# Altium schematic sheet AFE_Channel_4.SchDoc
size A; SheetNumber: 4; SheetTotal: 8; SPICEModelCacheNYXNLLFB: <root> / <DocumentId>NYXNLLFB</DocumentId> / <CacheFrame Number="0"> / <Model Name="mcp6401" Kind="CKT"> / <Text>.SUBCKT MCP6401 1 2 3 4 5 / *               | | | | | / *               | | | | Output / *               | | | Negative Supply / *               | | Positive Supply / *               | Inverting Input / *               Non-inverting Input / * / ******************************************************************************** / * Software License Agreement                                                   * / *                                                                              * / * The software supplied herewith by Microchip Technology Incorporated (the     * / * 'Company') is intended and supplied to you, the Company's customer, for use  * / * soley and exclusively on Microchip products.                                 * / *                                                                              * / * The software is owned by the Company and/or its supplier, and is protected   * / * under applicable copyright laws. All rights are reserved. Any use in         * / * violation of the foregoing restrictions may subject the user to criminal     * / * sanctions under applicable laws, as well as to civil liability for the       * / * breach of the terms and conditions of this license.                          * / *                                                                              * / * THIS SOFTWARE IS PROVIDED IN AN 'AS IS' CONDITION. NO WARRANTIES, WHETHER    * / * EXPRESS, IMPLIED OR STATUTORY, INCLUDING, BUT NOT LIMITED TO, IMPLIED        * / * WARRANTIES OF MERCHANTABILITY AND FITNESS FOR A PARTICULAR PURPOSE APPLY TO  * / * THIS SOFTWARE. THE COMPANY SHALL NOT, IN ANY CIRCUMSTANCES, BE LIABLE FOR    * / * SPECIAL, INCIDENTAL OR CONSEQUENTIAL DAMAGES, FOR ANY REASON WHATSOEVER.     * / ******************************************************************************** / * / * The following op-amps are covered by this model: / *      MCP6401, MCP6401R, MCP6401U, MCP6402, MCP6404, MCP6406, MCP6407, MCP6409 / * / * / * Revision History: / *      REV A: 10-Oct-10, Created model / *      REV B: 09-Jul-12, Added MCP6406, MCP6407, MCP6409 / * / * Recommendations: / *      Use PSPICE (or SPICE 2G6; other simulators may require translation) / *      For a quick, effective design, use a combination of: data sheet / *            specs, bench testing, and simulations with this macromodel / *      For high impedance circuits, set GMIN=100F in the .OPTIONS statement / * / * Supported: / *      Typical performance for temperature range (-40 to 125) degrees Celsius / *      DC, AC, Transient, and Noise analyses. / *      Most specs, including: offsets, DC PSRR, DC CMRR, input impedance, / *            open loop gain, voltage ranges, supply current, ... , etc. / *      Temperature effects for Ibias, Iquiescent, Iout short circuit / *            current, Vsat on both rails, Slew Rate vs. Temp and P.S. / * / * Not Supported: / *      Some Variation in specs vs. Power Supply Voltage / *      Vos distribution, Ib distribution for Monte Carlo / *      Distortion (detailed non-linear behavior) / *      Some Temperature analysis / *      Process variation / *      Behavior outside normal operating region / * / * / * Input Stage / V10  3 10 -400M / R10 10 11 1.00MEG / R11 10 12 1.00MEG / G10 10 11 10 11 100U / G11 10 12 10 12 100U / C11 11 12 397E-15 / C12  1  0 6P / E12 71 14 POLY(6) 20 0 21 0 22 0 23 0 26 0 27 0   4.5M 11.7 11.7 3.6 3.6 1 1 / G12 1 0 62 0 1m / G13 1 2 63 0 1u / M12 11 14 15 15 NMI / M14 12 2 15 15 NMI / G14 2 0 62 0 1m / C14  2  0 6P / C13 1 2 3P / I15 15 4 20.0U / V16 16 4 -200M / GD16 16 1 TABLE {V(16,1)} ((-100,-1p)(0,0)(1m,1u)(2m,1m)) / V13 3 13 -200M / GD13 2 13 TABLE {V(2,13)} ((-100,-1p)(0,0)(1m,1u)(2m,1m)) / R71  1  0 20.0E12 / R72  2  0 20.0E12 / R73  1  2 20.0E12 / * / * Noise, PSRR, and CMRR / I20 21 20 423U / D20 20  0 DN1 / D21  0 21 DN1 / I22 22 23 1N / R22 22 0  1k / R23  0 23 1k / G26  0 26 POLY(2) 3 0 4 0   0.00 -79.4U -100U / R26 26  0 1 / G27  0 27 POLY(2) 1 0 2 0  -847U 40U 40U / R27 27  0 1 / * / * Open Loop Gain, Slew Rate / G30  0 30 12 11 1 / R30 30  0 1.00K / G31 0 31 3 4 3.9 / I31 0 31 DC 51.5 / R31 31  0 1 TC=3.03M,2.40U / GD31 30 0 TABLE {V(30,31)} ((-100,-1n)(0,0)(1m,0.1)(2m,2)) / CD31 31 30 2p / G32 32 0 3 4 2.2 / I32 32 0 DC 93 / R32 32  0 1 TC=2.22M,-2.72U / GD32 0 30 TABLE {V(30,32)} ((-2m,2)(-1m,0.1)(0,0)(100,-1n)) / CD32 32 30 2p / G33  0 33 30 0 1m / R33  33 0 1K / G34  0 34 33 0 0.325 / R34  34 0 1K / C34  34 0 50.3U / G37  0 37 34 0 1m / R37  37 0 1K / C37  37 0 63.6P / G38  0 38 37 0 1m / R38  39 0 1K / L38  38 39 79.5U / E38  35 0 38 0 1 / G35 33 0 TABLE {V(35,3)} ((-1,-1n)(0,0)(90,1n))(91,1)) / G36 33 0 TABLE {V(35,4)} ((-91,-1)((-90,-1n)(0,0)(1,1n)) / * / * Output Stage / R80 50 0 100MEG / G50 0 50 57 96 2 / R58 57  96 0.50 / R57 57  0 1.2K / C58  5  0 2.00P / G57  0 57 POLY(3) 3 0 4 0 35 0 0 312U 416U 833U / GD55 55 57 TABLE {V(55,57)} ((-2m,-1)(-1m,-1m)(0,0)(10,1n)) / CD55 55 57 2p / CD56 57 56 2p / GD56 57 56 TABLE {V(57,56)} ((-2m,-1)(-1m,-1m)(0,0)(10,1n)) / E55 55  0 POLY(2) 3 0 51 0 2M 1 -54M / E56 56  0 POLY(2) 4 0 52 0 1.2M 1 -50M / R51 51 0 1k / R52 52 0 1k / GD51 50 51 TABLE {V(50,51)} ((-10,-1n)(0,0)(1m,1m)(2m,1)) / GD52 50 52 TABLE {V(50,52)}  ((-2m,-1)(-1m,-1m)(0,0)(10,1n)) / CD51 50 52 2p / CD52 50 51 2p / G53  3  0 POLY(1) 51 0  -20.0U 1M / G54  0  4 POLY(1) 52 0  -20.0U -1M / * / * Current Limit / G99 96 5 99 0 1 / R98 0 98 1 TC=-3.71M,8.17U / G97 0 98 TABLE { V(96,5) } ((-12.0,-7.00M)(-1.00M,-6.93M)(0,0)(1.00M,6.93M)(12.0,7.00M)) / E97 99 0 VALUE { V(98)*((V(3)-V(4))*428M + 142M)} / D98 4 5 DESD / D99 5 3 DESD / * / * Temperature / Voltage Sensitive IQuiscent / R61 0 61 1 TC=2.24M,3.12U / G61 3 4 61 0 1 / G60 0 61 TABLE {V(3,4)} / + ((0,0)(800M,440N)(850M,3.00U)(1.3,40.0U) / + (1.4,42.0U)(5.00,46.0U)(7.00,50.0U)) / * / * Temperature Sensitive offset voltage / I73 0 70 DC 1uA / R74 0 70 1 TC=2.00 / E75 1 71 70 0 1 / * / * Temp Sensistive IBias / I62 0 62 DC 1uA / R62 0 62 REXP  1.1m / * / * Temp Sensistive Offset IBias / I63 0 63 DC 1uA / R63 0 63 1.1 TC=30.4M,454U / * / * Models / .MODEL NMI NMOS(L=2.00U W=50.0U KP=20.0U LEVEL=1 ) / .MODEL DESD  D   N=1 IS=1.00E-15 / .MODEL DN1 D   IS=1P KF=146E-18 AF=1 / .MODEL REXP  RES TCE= 6.6 / .ENDS MCP6401</Text> / </Model> / </CacheFrame> / </root>
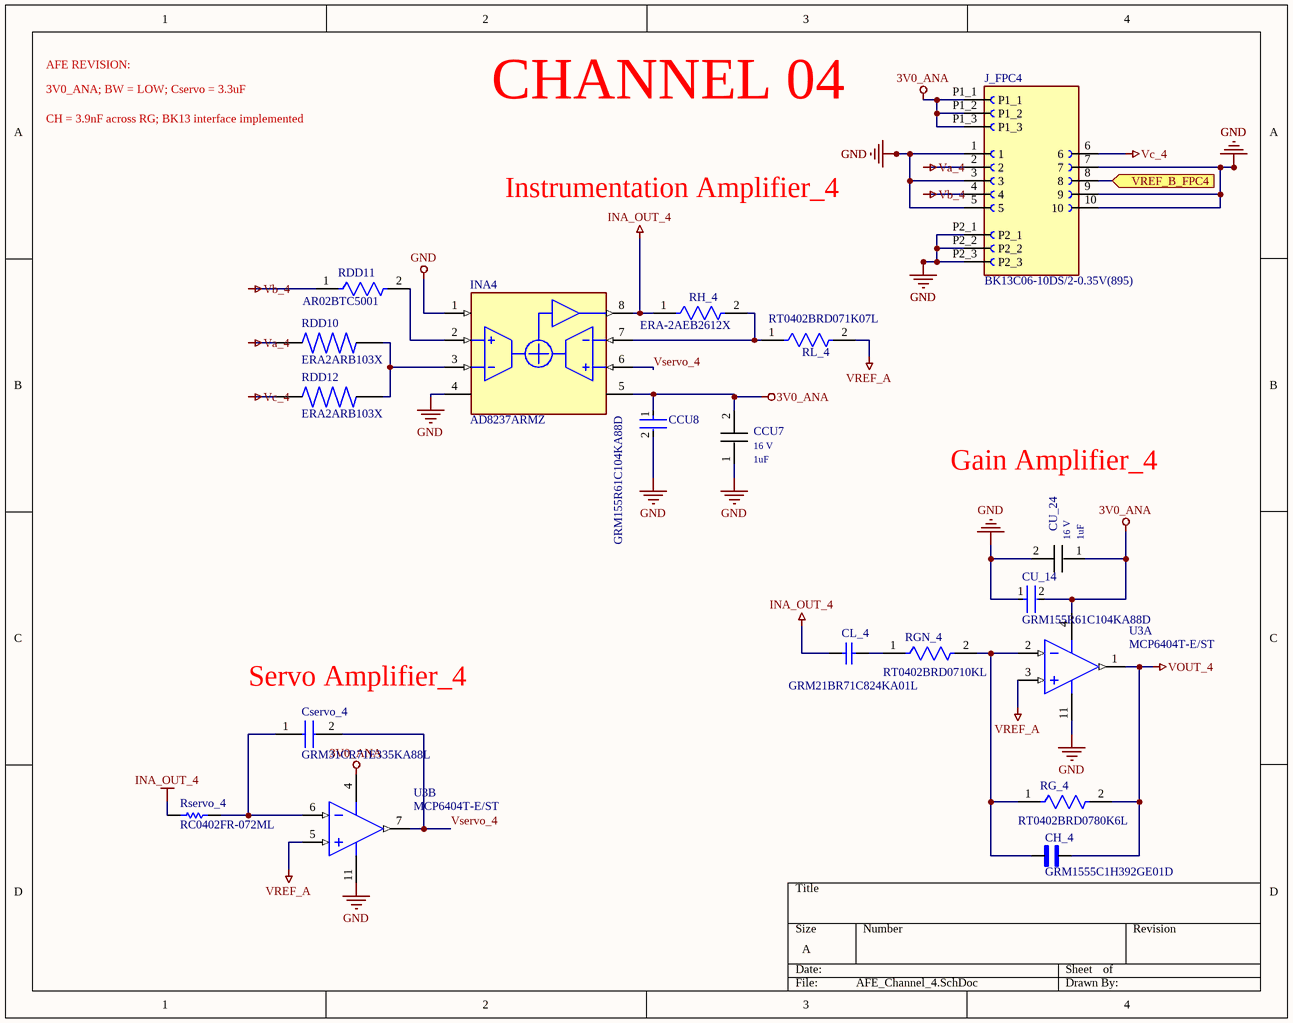
[diagram p0: AFE_Channel_4.SchDoc]

## Parts
CCU7  MURATA_GRM155C71C105KE11D  [*MURATA_GRM155C71C105KE11D_0]  (value not drawn)
CCU8  GRM155R61C104KA88D  [FP-GRM155-0_05-IPC_C]
CH_4  GRM1555C1H392GE01D  [CAPC1005X55N]
CL_4  GRM21BR71C824KA01L  [CAPC2013X135X45ML10T25]
Cservo_4  GRM31CR71E335KA88L  [GRM31x]
CU_14  GRM155R61C104KA88D  [FP-GRM155-0_05-IPC_C]
CU_24  MURATA_GRM155C71C105KE11D  [*MURATA_GRM155C71C105KE11D_0]  (value not drawn)
INA4  AD8237ARMZ  [EMG_AD8237_R3_MSOP8]
J_FPC4  BK13C06-10DS/2-0.35V(895)  [HIROSE_BK13C06-10DS/2-0.35V(895)]
RDD10  ERA2ARB103X  [RES_ERA2ARB103X]
RDD11  AR02BTC5001  [FP-AC0402-MFG]
RDD12  ERA2ARB103X  [RES_ERA2ARB103X]
RG_4  RT0402BRD0780K6L  [FP-RT0402-MFG]
RGN_4  RT0402BRD0710KL  [FP-RT0402-MFG]
RH_4  ERA-2AEB2612X  [FP-AC0402-IPC_A]
RL_4  RT0402BRD071K07L  [FP-RT0402-MFG]
Rservo_4  RC0402FR-072ML  [RESC1005X40X25NL05T10]
U3  MCP6404T-E/ST  [TSSOP-ST14_N]  (parts A,B of 4)

## Ports
VREF_B_FPC4 (in)

## Nets
3V0_ANA: CCU7.2 CCU8.1 CU_14.2 CU_24.1 INA4.5(+VS) J_FPC4.P1_1 J_FPC4.P1_2 J_FPC4.P1_3 U3.4(VDD)
GND: CCU7.1 CCU8.2 CU_14.1 CU_24.2 INA4.1(BW) INA4.4(-VS) J_FPC4.1 J_FPC4.3 J_FPC4.5 J_FPC4.7 J_FPC4.9 J_FPC4.10 J_FPC4.P2_1 J_FPC4.P2_2 J_FPC4.P2_3 U3.11(VSS)
INA_OUT_4: CL_4.2 INA4.8(VOUT) RH_4.1 Rservo_4.2
Va_4: J_FPC4.2 RDD10.1
Vb_4: J_FPC4.4 RDD11.1
Vc_4: J_FPC4.6 RDD12.1
VOUT_4: CH_4.1 RG_4.2 U3.1(VOUTA)
VREF_A: RL_4.2 U3.3(VINA+) U3.5(VINB+)
VREF_B_FPC4: J_FPC4.8 ; port VREF_B_FPC4
Vservo_4: Cservo_4.2 INA4.6(REF) U3.7(VOUTB)
NetCH_4_2: CH_4.2 RG_4.1 RGN_4.2 U3.2(VINA-)
NetCL_4_1: CL_4.1 RGN_4.1
NetCservo_4_1: Cservo_4.1 Rservo_4.1 U3.6(VINB-)
NetINA4_2: INA4.2(+IN) RDD11.2
NetINA4_3: INA4.3(-IN) RDD10.2 RDD12.2
NetINA4_7: INA4.7(FB) RH_4.2 RL_4.1

## Notes on the sheet
- 3V0_ANA; BW = LOW; Cservo = 3.3uF
- AFE REVISION:
- CH = 3.9nF across RG; BK13 interface implemented
- CHANNEL 04
- Instrumentation Amplifier_4
- Gain Amplifier_4
- (near Cservo_4) Servo Amplifier_4
- (in symbol EMG_R5_CCU7) 1uF
- (in symbol EMG_R5_CU_24) 1uF

## Library data of the parts
CCU7 = EMG_R5_CCU7: Murata GRM155C71C105KE11D: 1 uF 16 V X7S +/-10%, 0402/1005 metric; Value: 1 uF; Controlled Revision: R5 2026-09-16; project-local frozen symbol/footprint; Voltage Rating: 16 V; SnapEDA_Link: https://www.snapeda.com/parts/GRM155C71C105KE11D/Murata/view-part/?ref=snap; Package: 0402 / 1005 metric; MF: Murata; MP: GRM155C71C105KE11D; Check_prices: https://www.snapeda.com/parts/GRM155C71C105KE11D/Murata/view-part/?ref=eda; Manufacturer: Murata; Manufacturer Part Number: GRM155C71C105KE11D; Capacitance: 1 uF; Dielectric: X7S; Tolerance: +/-10%
CCU8 = EMG_R5_CCU8: CAP CER 0.1UF 16V X5R 0402; Tolerance: 10%; Capacitance: 100nF; Controlled Revision: R5 2026-09-16; project-local frozen symbol/footprint; Size: 0.5mm; Case Code (Imperial): 0402; Voltage: 16V; REACH SVHC: No SVHC; Packaging: Tape and Reel; Case/Package: 0402; Package Quantity: 1; Max Operating Temperature: 85°C; Voltage Rating (DC): 16V; Min Operating Temperature: -55°C; Construction: Flat; Mount: Surface Mount; Voltage Rating: 16V; Thickness: 0.022inch; Depth: 0.5mm; Termination: SMD/SMT; Length: 1mm; Height: 0.5mm; Series: GRM; Radiation Hardening: No; Width: 0.02inch; RoHS Compliant: Yes; Lead Free: Lead Free; Case Code (Metric): 1005; Dielectric: X5R
CH_4 = EMG_R5_CH_4: SMD capacitor C0G(EIA) with capacitance 3900pF Tol.2%. Rated voltage 50Vdc 125C; MF: Murata Electronics; Controlled Revision: R5 2026-09-16; project-local frozen symbol/footprint; Value: *; Package: 1005-2 Murata; SnapEDA_Link: https://www.snapeda.com/parts/GRM1555C1H392GE01D/Murata/view-part/?ref=snap; MP: GRM1555C1H392GE01D; Check_prices: https://www.snapeda.com/parts/GRM1555C1H392GE01D/Murata/view-part/?ref=eda
CL_4 = EMG_R5_CL_4: Manufacturer: Murata; Controlled Revision: R5 2026-09-16; project-local frozen symbol/footprint; Part Number: GRM21BR71C824KA01L
Cservo_4 = EMG_R5_Cservo_4: Capacitor; Manufacturer_Name: Murata Electronics; Manufacturer: Murata; Controlled Revision: R5 2026-09-16; project-local frozen symbol/footprint; Capacitance: 3.3 uF; Voltage Rating: 25 V; Dielectric: X7R; Tolerance: +/-10%; Datasheet Link: https://search.murata.co.jp/Ceramy/image/img/A01X/G101/ENG/GRM31CR71E335KA88-01.pdf; Height: 1.6 +/-0.2 mm; Manufacturer_Part_Number: GRM31CR71E335KA88L; Mouser Part Number: 81-GRM31CR71E335KA8L; Mouser Price/Stock: https://www.mouser.co.uk/ProductDetail/Murata-Electronics/GRM31CR71E335KA88L?qs=O9nxk9bDVAjJxWOahKXrZA%3D%3D; Arrow Part Number: GRM31CR71E335KA88L; Arrow Price/Stock: https://www.arrow.com/en/products/grm31cr71e335ka88l/murata-manufacturing?region=europe; Manufacturer Part Number: GRM31CR71E335KA88L; Package: 1206 / 3216 metric
CU_14 = EMG_R5_CU_14: CAP CER 0.1UF 16V X5R 0402; Tolerance: 10%; Capacitance: 100nF; Controlled Revision: R5 2026-09-16; project-local frozen symbol/footprint; Size: 0.5mm; Case Code (Imperial): 0402; Voltage: 16V; REACH SVHC: No SVHC; Packaging: Tape and Reel; Case/Package: 0402; Package Quantity: 1; Max Operating Temperature: 85°C; Voltage Rating (DC): 16V; Min Operating Temperature: -55°C; Construction: Flat; Mount: Surface Mount; Voltage Rating: 16V; Thickness: 0.022inch; Depth: 0.5mm; Termination: SMD/SMT; Length: 1mm; Height: 0.5mm; Series: GRM; Radiation Hardening: No; Width: 0.02inch; RoHS Compliant: Yes; Lead Free: Lead Free; Case Code (Metric): 1005; Dielectric: X5R
CU_24 = EMG_R5_CU_24: Murata GRM155C71C105KE11D: 1 uF 16 V X7S +/-10%, 0402/1005 metric; Value: 1 uF; Controlled Revision: R5 2026-09-16; project-local frozen symbol/footprint; Voltage Rating: 16 V; SnapEDA_Link: https://www.snapeda.com/parts/GRM155C71C105KE11D/Murata/view-part/?ref=snap; Package: 0402 / 1005 metric; MF: Murata; MP: GRM155C71C105KE11D; Check_prices: https://www.snapeda.com/parts/GRM155C71C105KE11D/Murata/view-part/?ref=eda; Manufacturer: Murata; Manufacturer Part Number: GRM155C71C105KE11D; Capacitance: 1 uF; Dielectric: X7S; Tolerance: +/-10%
INA4 = EMG_R5_INA4: Micropower, Zero Drift, True Rail-to-Rail Instrumentation Amplifier; MF: Analog Devices; EMG Library Revision: R3 2026-09-12; EMG_AD8237_R3_MSOP8; numeric pad IDs 1-8; Controlled Revision: R5 2026-09-16; project-local frozen symbol/footprint; Package: MSOP-8 Analog Devices; Price: None; Check_prices: https://www.snapeda.com/parts/AD8237ARMZ/Analog+Devices/view-part/?ref=eda; Value: *; SnapEDA_Link: https://www.snapeda.com/parts/AD8237ARMZ/Analog+Devices/view-part/?ref=snap; MP: AD8237ARMZ; Availability: In Stock; Purchase-URL: https://pricing.snapeda.com/search?q=AD8237ARMZ&ref=eda
J_FPC4 = EMG_R5_J_FPC4: 10 Position Connector Receptacle, Center Strip Contacts Surface Mount Gold; MF: Hirose Electric Co Ltd; Controlled Revision: R5 2026-09-16; project-local frozen symbol/footprint; SnapEDA_Link: https://www.snapeda.com/parts/BK13C06-10DS/2-0.35V(895)/Hirose+Electric+Co+Ltd/view-part/?ref=snap; Package: None; Value: *; MP: BK13C06-10DS/2-0.35V(895); Check_prices: https://www.snapeda.com/parts/BK13C06-10DS/2-0.35V(895)/Hirose+Electric+Co+Ltd/view-part/?ref=eda
RDD10 = EMG_R5_RDD10: Controlled Revision: R5 2026-09-16; project-local frozen symbol/footprint; MP: ERA2ARB103X; Price: None; Availability: Unavailable; Package: None; Value: *
RDD11 = EMG_R5_RDD11: -55℃~+155℃ 50V 5kΩ 63mW Thin Film Resistor ±0.1% ±25ppm/℃ 0402 Chip Resistor - Surface Mount ROH; Manufacturer: Viking Tech; Automotive Grade: Grade 0; Power Rating: 0.0625W; Controlled Revision: R5 2026-09-16; project-local frozen symbol/footprint; Resistance: 5KΩ; Automotive: No; Device Class L1: Passive Components; Temperature Range High: +155°C; ComponentLink2URL: https://www.viking.com.tw/Templates/att/Thin%20Film%20Resistor%20short%20form.pdf; Footprint Url: https://www.viking.com.tw/Templates/att/Thin%20Film%20Resistor%20short%20form.pdf; RoHS: TRUE; Category: Resistors/Chip Resistor - Surface Mount; Package: AR0402; Octopart: https://octopart.com/datasheet/viking-tech/AR02BTC5001; Device Class L2: Resistors; Series: AR; Voltage Rating: 50V; Height: 0.35mm; ComponentLink2Description: Datasheet; Lead Free: Yes; Temperature Range Low: -55°C; Value: 5KΩ; Temperature: -55°C to +155°C; Ipc Land Pattern Name: RESC10050X32; Device Class L3: Chip SMD Resistors; Manufacturer Part Number: AR02BTC5001; Composition: Thin Film; Tolerance: ±0.1%; LCSC Part: C5948099
RDD12 = EMG_R5_RDD12: Controlled Revision: R5 2026-09-16; project-local frozen symbol/footprint; MP: ERA2ARB103X; Price: None; Availability: Unavailable; Package: None; Value: *
RG_4 = EMG_R5_RG_4: RES SMD 80.6KOHM 0.1% 1/16W 0402; Manufacturer: Yageo; Power Rating: 0.063W; Temperature Coefficient: 25 ppm/°C; Resistance: 80.6KΩ; Voltage Rating: 50V; Tolerance: 0.001; Value: 80.6KΩ; Controlled Revision: R5 2026-09-16; project-local frozen symbol/footprint; Manufacturer Part Number: RT0402BRD0780K6L; Device Class L2: Resistors; Temperature Range Low: -55°C; Device Class L3: Chip SMD Resistors; Temperature: -55°C to +155°C; Ipc Land Pattern Name: RESC10050X30; Mouser Description: Thin Film Resistors 1/16W 80.6K ohm .1% 25ppm; Footprint Url: http://www.yageo.com/exep/pages/download/literatures/PYu-R_Mount_10.pdf; Lead Free: Yes; Category: Res; Composition: Thin Film; RoHS: TRUE; Octopart: https://octopart.com/rt0402brd0780k6l-yageo-1468076; Automotive: No; ComponentLink2Description: Datasheet; Package: RT0402; Digikey Description: RES SMD 80.6KOHM 0.1% 1/16W 0402; Height: 0.35mm; Temperature Range High: +155°C; Device Class L1: Passive Components; Series: RT; ComponentLink2URL: http://www.yageo.com/documents/recent/PYu-RT_1-to-0.01_RoHS_L_9.pdf
RGN_4 = EMG_R5_RGN_4: RES 10.0K OHM 1/16W .1% SMD 0402; Manufacturer: Yageo; Value: 10KΩ; Voltage Rating: 50V; Power Rating: 0.063W; Temperature Coefficient: 25 ppm/°C; Tolerance: 0.001; Controlled Revision: R5 2026-09-16; project-local frozen symbol/footprint; Height: 0.35mm; Ipc Land Pattern Name: RESC10050X30; Device Class L1: Passive Components; Mouser Description: Thin Film Resistors - SMD 10K ohm 0.1% 1/16W; ComponentLink2URL: http://www.yageo.com/documents/recent/PYu-RT_1-to-0.01_RoHS_L_9.pdf; Automotive: No; Series: RT; Package: RT0402; ComponentLink2Description: Datasheet; Footprint Url: http://www.yageo.com/exep/pages/download/literatures/PYu-R_Mount_10.pdf; Digikey Description: RES 10.0K OHM 1/16W .1% SMD 0402; Resistance: 10KΩ; Temperature Range High: +155°C; Device Class L3: Chip SMD Resistors; Manufacturer Part Number: RT0402BRD0710KL; Lead Free: Yes; Category: Res; Device Class L2: Resistors; RoHS: TRUE; Temperature Range Low: -55°C; Composition: Thin Film; Temperature: -55°C to +155°C; Octopart: https://octopart.com/rt0402brd0710kl-yageo-1181432
RH_4 = EMG_R5_RH_4: RES 26.1kΩ ±0.1% 0.063W 0402; Manufacturer: PANASONIC; Max Power Dissipation: 63mW; Temperature Coefficient: 25ppm/°C; Voltage Rating: 50V; Power Rating: 62.5mW; Resistance: 26.1kR; Controlled Revision: R5 2026-09-16; project-local frozen symbol/footprint; Number of Terminations: 2; Termination: SMD/SMT; Case Code (Metric): 1005; Case/Package: 0402; RoHS Compliant: Yes; Width: 0.5mm; Max Operating Temperature: 155°C; Case Code (Imperial): 0402; Packaging: Tape and Reel; Features: Moisture Resistant; Height: 0.015inch; Length: 0.039inch; Series: ERA-2A; Resistor Type: Thin Film; Min Operating Temperature: -55°C; Tolerance: 0.1%; JLCPCB Part: C2075472
RL_4 = EMG_R5_RL_4: RES SMD 1.07K OHM 0.1% 1/16W; Manufacturer: Yageo; Resistance: 1.07KΩ; Voltage Rating: 50V; Value: 1.07KΩ; Temperature Coefficient: 25 ppm/°C; Tolerance: 0.001; Power Rating: 0.063W; Controlled Revision: R5 2026-09-16; project-local frozen symbol/footprint; Composition: Thin Film; Height: 0.35mm; Octopart: https://octopart.com/rt0402brd071k07l-yageo-1400807; Package: RT0402; Device Class L3: Chip SMD Resistors; Manufacturer Part Number: RT0402BRD071K07L; ComponentLink2Description: Datasheet; Lead Free: Yes; Automotive: No; Device Class L1: Passive Components; Temperature Range Low: -55°C; RoHS: TRUE; Category: Res; Temperature Range High: +155°C; Mouser Description: Thin Film Resistors 1/16W 1.07K ohm .1% 25ppm; Device Class L2: Resistors; Digikey Description: RES SMD 1.07K OHM 0.1% 1/16W; Footprint Url: http://www.yageo.com/exep/pages/download/literatures/PYu-R_Mount_10.pdf; ComponentLink2URL: http://www.yageo.com/documents/recent/PYu-RT_1-to-0.01_RoHS_L_9.pdf; Ipc Land Pattern Name: RESC10050X30; Series: RT; Temperature: -55°C to +155°C
Rservo_4 = EMG_R5_Rservo_4: Manufacturer: Yageo / Phycomp; Controlled Revision: R5 2026-09-16; project-local frozen symbol/footprint; Part Number: RC0402FR-072ML
U3 = EMG_R5_U3: None; Nominal Supply Current: 45uA; Power Supply Rejection Ratio (PSRR): 63dB; Unity Gain Bandwidth Product: 1MHz; Amplifier Type: GENERAL PURPOSE; Voltage Gain: 110dB; Number of Channels: 4; Output Current: 15mA; Max Supply Voltage: 6V; Min Supply Voltage: 1.8V; Slew Rate: 0.5V/µs; Input Bias Current: 100pA; Input Offset Voltage (Vos): 4.5mV; Common Mode Rejection Ratio: 56dB; Controlled Revision: R5 2026-09-16; project-local frozen symbol/footprint; Number of Pins: 14; Case/Package: TSSOP; Packaging: Tape and Reel; Technology: CMOS; Lead Free: Lead Free; Max Operating Temperature: 125°C; Mount: Surface Mount; Number of Circuits: 4; Number of Elements: 4; Supply Current: 45uA; RoHS Compliant: Yes; Gain Bandwidth Product: 1MHz; Min Operating Temperature: -40°C